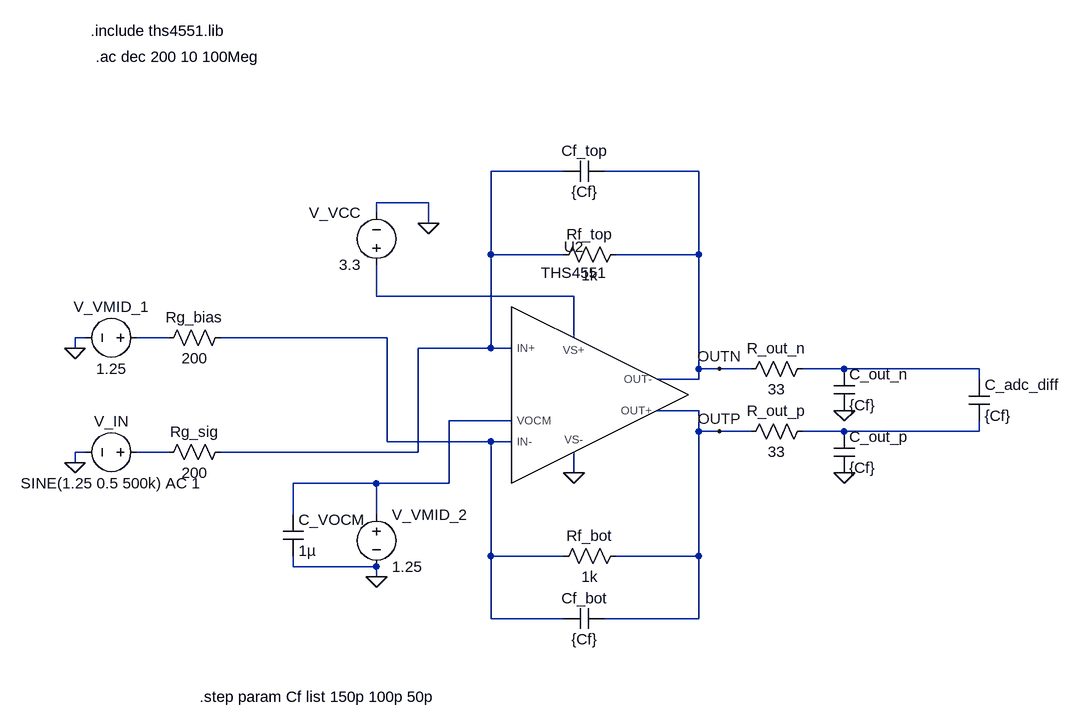
[diagram p0: schematic adcdrivingsimulation.asc]
adcdrivingsimulation.asc, the LTspice schematic file:
Version 4
SHEET 1 1272 1208
WIRE -48 384 -160 384
WIRE 160 384 16 384
WIRE -256 432 -336 432
WIRE -336 448 -336 432
WIRE -256 464 -256 432
WIRE -160 512 -160 384
WIRE -48 512 -160 512
WIRE 160 512 160 384
WIRE 160 512 32 512
WIRE -336 576 -336 528
WIRE -32 576 -336 576
WIRE -784 640 -800 640
WIRE -656 640 -704 640
WIRE -320 640 -576 640
WIRE -32 640 -32 576
WIRE -800 656 -800 640
WIRE -160 656 -160 512
WIRE -160 656 -272 656
WIRE -128 656 -160 656
WIRE 160 688 160 512
WIRE 192 688 160 688
WIRE 240 688 192 688
WIRE 384 688 320 688
WIRE 592 688 384 688
WIRE 160 704 160 688
WIRE 160 704 96 704
WIRE 592 704 592 688
WIRE 160 752 96 752
WIRE -128 768 -224 768
WIRE 160 784 160 752
WIRE 192 784 160 784
WIRE 240 784 192 784
WIRE 384 784 320 784
WIRE 592 784 592 768
WIRE 592 784 384 784
WIRE -320 800 -320 640
WIRE -160 800 -320 800
WIRE -128 800 -160 800
WIRE -784 816 -800 816
WIRE -656 816 -704 816
WIRE -272 816 -272 656
WIRE -272 816 -576 816
WIRE -800 832 -800 816
WIRE -32 848 -32 816
WIRE -336 864 -464 864
WIRE -224 864 -224 768
WIRE -224 864 -336 864
WIRE -464 912 -464 864
WIRE -336 912 -336 864
WIRE -160 976 -160 800
WIRE -48 976 -160 976
WIRE 160 976 160 784
WIRE 160 976 32 976
WIRE -464 992 -464 976
WIRE -336 992 -464 992
WIRE -336 1008 -336 992
WIRE -160 1072 -160 976
WIRE -48 1072 -160 1072
WIRE 160 1072 160 976
WIRE 160 1072 16 1072
FLAG -800 656 0
FLAG -800 832 0
FLAG -336 1008 0
FLAG -256 464 0
FLAG 192 784 OUTP
FLAG 192 688 OUTN
FLAG -32 848 0
FLAG 384 752 0
FLAG 384 848 0
SYMBOL Voltage -336 544 R180
WINDOW 0 24 96 Left 2
WINDOW 3 24 16 Left 2
SYMATTR InstName V_VCC
SYMATTR Value 3.3
SYMBOL Voltage -336 896 R0
SYMATTR InstName V_VMID_2
SYMATTR Value 1.25
SYMBOL Voltage -688 640 R90
WINDOW 0 -32 56 VBottom 2
WINDOW 3 32 56 VTop 2
SYMATTR InstName V_VMID_1
SYMATTR Value 1.25
SYMBOL Voltage -688 816 R90
WINDOW 0 -32 56 VBottom 2
WINDOW 3 32 56 VTop 2
SYMATTR InstName V_IN
SYMATTR Value SINE(1.25 0.5 500k) AC 1
SYMBOL Res 336 768 R90
WINDOW 0 0 56 VBottom 2
WINDOW 3 32 56 VTop 2
SYMATTR InstName R_out_p
SYMATTR Value 33
SYMBOL Res 336 672 R90
WINDOW 0 0 56 VBottom 2
WINDOW 3 32 56 VTop 2
SYMATTR InstName R_out_n
SYMATTR Value 33
SYMBOL Res 48 496 R90
WINDOW 0 0 56 VBottom 2
WINDOW 3 32 56 VTop 2
SYMATTR InstName Rf_top
SYMATTR Value 1k
SYMBOL Cap 16 368 R90
WINDOW 0 0 32 VBottom 2
WINDOW 3 32 32 VTop 2
SYMATTR InstName Cf_top
SYMATTR Value {Cf}
SYMBOL Cap 16 1056 R90
WINDOW 0 0 32 VBottom 2
WINDOW 3 32 32 VTop 2
SYMATTR InstName Cf_bot
SYMATTR Value {Cf}
SYMBOL Res 48 960 R90
WINDOW 0 0 56 VBottom 2
WINDOW 3 32 56 VTop 2
SYMATTR InstName Rf_bot
SYMATTR Value 1k
SYMBOL Cap -480 912 R0
SYMATTR InstName C_VOCM
SYMATTR Value 1µ
SYMBOL Res -560 800 R90
WINDOW 0 0 56 VBottom 2
WINDOW 3 32 56 VTop 2
SYMATTR InstName Rg_sig
SYMATTR Value 200
SYMBOL Res -560 624 R90
WINDOW 0 0 56 VBottom 2
WINDOW 3 32 56 VTop 2
SYMATTR InstName Rg_bias
SYMATTR Value 200
SYMBOL THS4551 -64 720 R0
SYMATTR InstName U2
SYMBOL Cap 576 704 R0
SYMATTR InstName C_adc_diff
SYMATTR Value {Cf}
SYMBOL Cap 368 784 R0
SYMATTR InstName C_out_p
SYMATTR Value {Cf}
SYMBOL Cap 368 688 R0
SYMATTR InstName C_out_n
SYMATTR Value {Cf}
TEXT -776 168 Left 2 !.include ths4551.lib
TEXT -768 208 Left 2 !.ac dec 200 10 100Meg
TEXT -608 1192 Left 2 !.step param Cf list 150p 100p 50p

The netlist it stands for:
* adcdrivingsimulation.asc
V_VCC N002 0 3.3
V_VMID_2 N006 0 1.25
V_VMID_1 N003 0 1.25
V_IN N008 0 SINE(1.25 0.5 500k) AC 1
R_out_p N007 OUTP 33
R_out_n N005 OUTN 33
Rf_top OUTN N001 1k
Cf_top OUTN N001 {Cf}
Cf_bot OUTP N004 {Cf}
Rf_bot OUTP N004 1k
C_VOCM N006 0 1µ
Rg_sig N001 N008 200
Rg_bias N004 N003 200
XU2 N001 N004 OUTP OUTN N006 N002 0 THS4551  ; pins IN+ IN- OUT+ OUT- VOCM VS+ VS-
C_adc_diff N005 N007 {Cf}
C_out_p N007 0 {Cf}
C_out_n N005 0 {Cf}
.include ths4551.lib
.ac dec 200 10 100Meg
.step param Cf list 150p 100p 50p
.backanno
.end